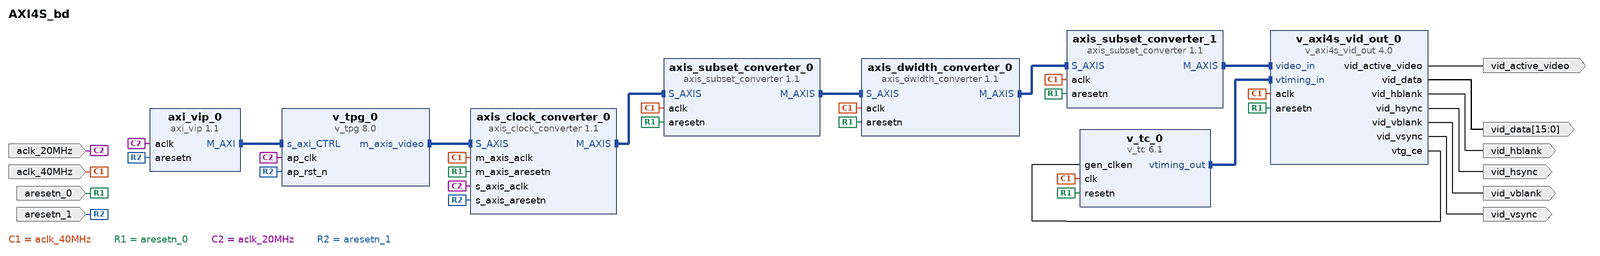
[diagram p0: block diagram of the top level]
# Vivado block design AXI4S_bd, xc7z020clg484-1, Vivado 2019.1
create_bd_design AXI4S_bd

create_bd_port -dir I -type clk aclk_40MHz
set_property -dict {CONFIG.ASSOCIATED_RESET aresetn_0 CONFIG.FREQ_HZ 40000000} [get_bd_ports aclk_40MHz]
create_bd_port -dir I -type clk aclk_20MHz
set_property -dict {CONFIG.ASSOCIATED_RESET aresetn_1:aresetn_1 CONFIG.FREQ_HZ 20000000} [get_bd_ports aclk_20MHz]
create_bd_port -dir I -type rst aresetn_0
create_bd_port -dir I -type rst aresetn_1
create_bd_port -dir O vid_active_video
create_bd_port -dir O -from 15 -to 0 -type data vid_data
create_bd_port -dir O vid_hblank
create_bd_port -dir O vid_hsync
create_bd_port -dir O vid_vblank
create_bd_port -dir O vid_vsync

create_bd_cell -type ip -vlnv xilinx.com:ip:axi_vip:1.1 axi_vip_0
set_property -dict [list \
  CONFIG.ADDR_WIDTH 12 \
  CONFIG.DATA_WIDTH 32 \
  CONFIG.HAS_BRESP 1 \
  CONFIG.HAS_PROT 1 \
  CONFIG.HAS_RRESP 1 \
  CONFIG.HAS_WSTRB 1 \
  CONFIG.INTERFACE_MODE MASTER \
  CONFIG.PROTOCOL AXI4LITE \
  CONFIG.READ_WRITE_MODE READ_WRITE \
] [get_bd_cells axi_vip_0]
create_bd_cell -type ip -vlnv xilinx.com:ip:v_axi4s_vid_out:4.0 v_axi4s_vid_out_0
set_property -dict {CONFIG.C_S_AXIS_VIDEO_FORMAT 0} [get_bd_cells v_axi4s_vid_out_0]
create_bd_cell -type ip -vlnv xilinx.com:ip:v_tc:6.1 v_tc_0
set_property -dict {CONFIG.HAS_AXI4_LITE false CONFIG.VIDEO_MODE 800x600p CONFIG.enable_detection false} [get_bd_cells v_tc_0]
create_bd_cell -type ip -vlnv xilinx.com:ip:v_tpg:8.0 v_tpg_0
set_property -dict {CONFIG.SAMPLES_PER_CLOCK 2} [get_bd_cells v_tpg_0]
create_bd_cell -type ip -vlnv xilinx.com:ip:axis_subset_converter:1.1 axis_subset_converter_0
set_property -dict [list \
  CONFIG.M_TDATA_NUM_BYTES 4 \
  CONFIG.M_TUSER_WIDTH 4 \
  CONFIG.S_TDATA_NUM_BYTES 6 \
  CONFIG.TDATA_REMAP {tdata[31:0]} \
  CONFIG.TKEEP_REMAP {tkeep[3:0]} \
  CONFIG.TSTRB_REMAP {tstrb[3:0]} \
  CONFIG.TUSER_REMAP {3'b000,tuser[0:0]} \
] [get_bd_cells axis_subset_converter_0]
create_bd_cell -type ip -vlnv xilinx.com:ip:axis_dwidth_converter:1.1 axis_dwidth_converter_0
create_bd_cell -type ip -vlnv xilinx.com:ip:axis_subset_converter:1.1 axis_subset_converter_1
set_property -dict {CONFIG.M_TUSER_WIDTH 1 CONFIG.TUSER_REMAP {tuser[0:0]}} [get_bd_cells axis_subset_converter_1]
create_bd_cell -type ip -vlnv xilinx.com:ip:axis_clock_converter:1.1 axis_clock_converter_0

# ---- connections ----

connect_bd_intf_net [get_bd_intf_pins axis_dwidth_converter_0/M_AXIS] [get_bd_intf_pins axis_subset_converter_1/S_AXIS]
connect_bd_intf_net [get_bd_intf_pins axis_subset_converter_0/M_AXIS] [get_bd_intf_pins axis_dwidth_converter_0/S_AXIS]
connect_bd_intf_net [get_bd_intf_pins v_axi4s_vid_out_0/vtiming_in] [get_bd_intf_pins v_tc_0/vtiming_out]
connect_bd_intf_net [get_bd_intf_pins axi_vip_0/M_AXI] [get_bd_intf_pins v_tpg_0/s_axi_CTRL]
connect_bd_intf_net [get_bd_intf_pins axis_subset_converter_1/M_AXIS] [get_bd_intf_pins v_axi4s_vid_out_0/video_in]
connect_bd_intf_net [get_bd_intf_pins v_tpg_0/m_axis_video] [get_bd_intf_pins axis_clock_converter_0/S_AXIS]
connect_bd_intf_net [get_bd_intf_pins axis_clock_converter_0/M_AXIS] [get_bd_intf_pins axis_subset_converter_0/S_AXIS]
connect_bd_net -net aclk_0_1 [get_bd_ports aclk_40MHz] \
  [get_bd_pins v_axi4s_vid_out_0/aclk] [get_bd_pins v_tc_0/clk] [get_bd_pins axis_subset_converter_0/aclk] \
  [get_bd_pins axis_dwidth_converter_0/aclk] [get_bd_pins axis_subset_converter_1/aclk] \
  [get_bd_pins axis_clock_converter_0/m_axis_aclk]
connect_bd_net -net aresetn_0_1 [get_bd_ports aresetn_0] \
  [get_bd_pins v_axi4s_vid_out_0/aresetn] [get_bd_pins v_tc_0/resetn] [get_bd_pins axis_subset_converter_0/aresetn] \
  [get_bd_pins axis_dwidth_converter_0/aresetn] [get_bd_pins axis_subset_converter_1/aresetn] \
  [get_bd_pins axis_clock_converter_0/m_axis_aresetn]
connect_bd_net [get_bd_pins v_axi4s_vid_out_0/vid_active_video] [get_bd_ports vid_active_video]
connect_bd_net [get_bd_pins v_axi4s_vid_out_0/vid_data] [get_bd_ports vid_data]
connect_bd_net [get_bd_pins v_axi4s_vid_out_0/vid_hblank] [get_bd_ports vid_hblank]
connect_bd_net [get_bd_pins v_axi4s_vid_out_0/vid_hsync] [get_bd_ports vid_hsync]
connect_bd_net [get_bd_pins v_axi4s_vid_out_0/vid_vblank] [get_bd_ports vid_vblank]
connect_bd_net [get_bd_pins v_axi4s_vid_out_0/vid_vsync] [get_bd_ports vid_vsync]
connect_bd_net [get_bd_pins v_axi4s_vid_out_0/vtg_ce] [get_bd_pins v_tc_0/gen_clken]
connect_bd_net [get_bd_ports aclk_20MHz] [get_bd_pins axis_clock_converter_0/s_axis_aclk] [get_bd_pins v_tpg_0/ap_clk] [get_bd_pins axi_vip_0/aclk]
connect_bd_net -net aresetn_1_1 [get_bd_ports aresetn_1] \
  [get_bd_pins v_tpg_0/ap_rst_n] [get_bd_pins axi_vip_0/aresetn] [get_bd_pins axis_clock_converter_0/s_axis_aresetn]

# ---- address map ----
assign_bd_address -offset 0x000 -range 4K -target_address_space [get_bd_addr_spaces axi_vip_0/Master_AXI] [get_bd_addr_segs v_tpg_0/s_axi_CTRL/Reg]

validate_bd_design
save_bd_design
